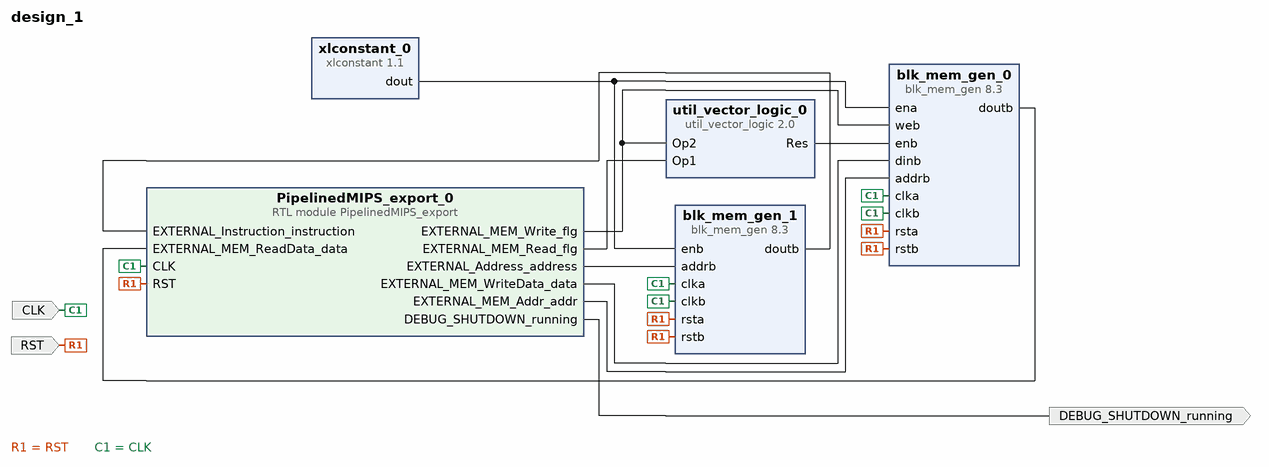
[diagram p0: block diagram of the top level]
# Vivado block design design_1, xc7z020clg484-1, Vivado 2017.1
create_bd_design design_1

create_bd_port -dir I -type rst RST
create_bd_port -dir I -type clk CLK
create_bd_port -dir O DEBUG_SHUTDOWN_running

create_bd_cell -type ip -vlnv xilinx.com:ip:util_vector_logic:2.0 util_vector_logic_0
set_property -dict {CONFIG.C_SIZE 1 CONFIG.C_OPERATION or} [get_bd_cells util_vector_logic_0]
create_bd_cell -type ip -vlnv xilinx.com:ip:blk_mem_gen:8.3 blk_mem_gen_0
set_property -dict [list \
  CONFIG.Memory_Type True_Dual_Port_RAM \
  CONFIG.Assume_Synchronous_Clk true \
  CONFIG.Enable_B Use_ENB_Pin \
  CONFIG.Use_RSTB_Pin true \
  CONFIG.Port_B_Clock 100 \
  CONFIG.Port_B_Write_Rate 50 \
  CONFIG.Port_B_Enable_Rate 100 \
] [get_bd_cells blk_mem_gen_0]
create_bd_cell -type ip -vlnv xilinx.com:ip:xlconstant:1.1 xlconstant_0
set_property -dict {CONFIG.CONST_VAL 1} [get_bd_cells xlconstant_0]
create_bd_cell -type ip -vlnv xilinx.com:ip:blk_mem_gen:8.3 blk_mem_gen_1
set_property -dict [list \
  CONFIG.Memory_Type True_Dual_Port_RAM \
  CONFIG.Enable_32bit_Address true \
  CONFIG.Assume_Synchronous_Clk true \
  CONFIG.Write_Depth_A 8192 \
  CONFIG.Enable_B Use_ENB_Pin \
  CONFIG.Register_PortA_Output_of_Memory_Primitives false \
  CONFIG.Register_PortB_Output_of_Memory_Primitives false \
  CONFIG.Load_Init_File true \
  CONFIG.Coe_File ../../../../../../../../Dropbox/Kandidat/MIPS/fibhaz.coe \
  CONFIG.Fill_Remaining_Memory_Locations false \
  CONFIG.Use_RSTA_Pin true \
  CONFIG.Use_RSTB_Pin true \
  CONFIG.Port_B_Clock 100 \
  CONFIG.Port_B_Write_Rate 50 \
  CONFIG.Port_B_Enable_Rate 100 \
  CONFIG.use_bram_block Stand_Alone \
] [get_bd_cells blk_mem_gen_1]
create_bd_cell -type module -reference PipelinedMIPS_export PipelinedMIPS_export_0

# ---- connections ----

connect_bd_net [get_bd_ports RST] \
  [get_bd_pins blk_mem_gen_0/rstb] [get_bd_pins blk_mem_gen_0/rsta] [get_bd_pins blk_mem_gen_1/rstb] \
  [get_bd_pins blk_mem_gen_1/rsta] [get_bd_pins PipelinedMIPS_export_0/RST]
connect_bd_net [get_bd_ports CLK] \
  [get_bd_pins blk_mem_gen_0/clkb] [get_bd_pins blk_mem_gen_0/clka] [get_bd_pins blk_mem_gen_1/clkb] \
  [get_bd_pins blk_mem_gen_1/clka] [get_bd_pins PipelinedMIPS_export_0/CLK]
connect_bd_net -net PipelinedMIPS_export_0_EX_Pipe_MemWrite_flg [get_bd_pins PipelinedMIPS_export_0/EXTERNAL_MEM_Write_flg] \
  [get_bd_pins util_vector_logic_0/Op2] [get_bd_pins blk_mem_gen_0/web]
connect_bd_net [get_bd_pins PipelinedMIPS_export_0/DEBUG_SHUTDOWN_running] [get_bd_ports DEBUG_SHUTDOWN_running]
connect_bd_net [get_bd_pins util_vector_logic_0/Res] [get_bd_pins blk_mem_gen_0/enb]
connect_bd_net [get_bd_pins xlconstant_0/dout] [get_bd_pins blk_mem_gen_1/enb] [get_bd_pins blk_mem_gen_0/ena]
connect_bd_net [get_bd_pins PipelinedMIPS_export_0/EXTERNAL_Address_address] [get_bd_pins blk_mem_gen_1/addrb]
connect_bd_net [get_bd_pins blk_mem_gen_1/doutb] [get_bd_pins PipelinedMIPS_export_0/EXTERNAL_Instruction_instruction]
connect_bd_net [get_bd_pins PipelinedMIPS_export_0/EXTERNAL_MEM_WriteData_data] [get_bd_pins blk_mem_gen_0/dinb]
connect_bd_net [get_bd_pins PipelinedMIPS_export_0/EXTERNAL_MEM_Addr_addr] [get_bd_pins blk_mem_gen_0/addrb]
connect_bd_net [get_bd_pins PipelinedMIPS_export_0/EXTERNAL_MEM_Read_flg] [get_bd_pins util_vector_logic_0/Op1]
connect_bd_net [get_bd_pins blk_mem_gen_0/doutb] [get_bd_pins PipelinedMIPS_export_0/EXTERNAL_MEM_ReadData_data]

validate_bd_design
save_bd_design
